# Altium schematic sheet Battery Manager.SchDoc: Battery Manager
size Tabloid; ApprovedBy: NA; CompanyName: Cospan Design LLC; DrawnBy: David McCoy; Engineer: David McCoy; DocumentNumber: 14; Revision: A; SheetNumber: 14; SheetTotal: 18; Client: OSH; ProjectPrettyName: Guppy Buddy; Project: Guppy Buddy
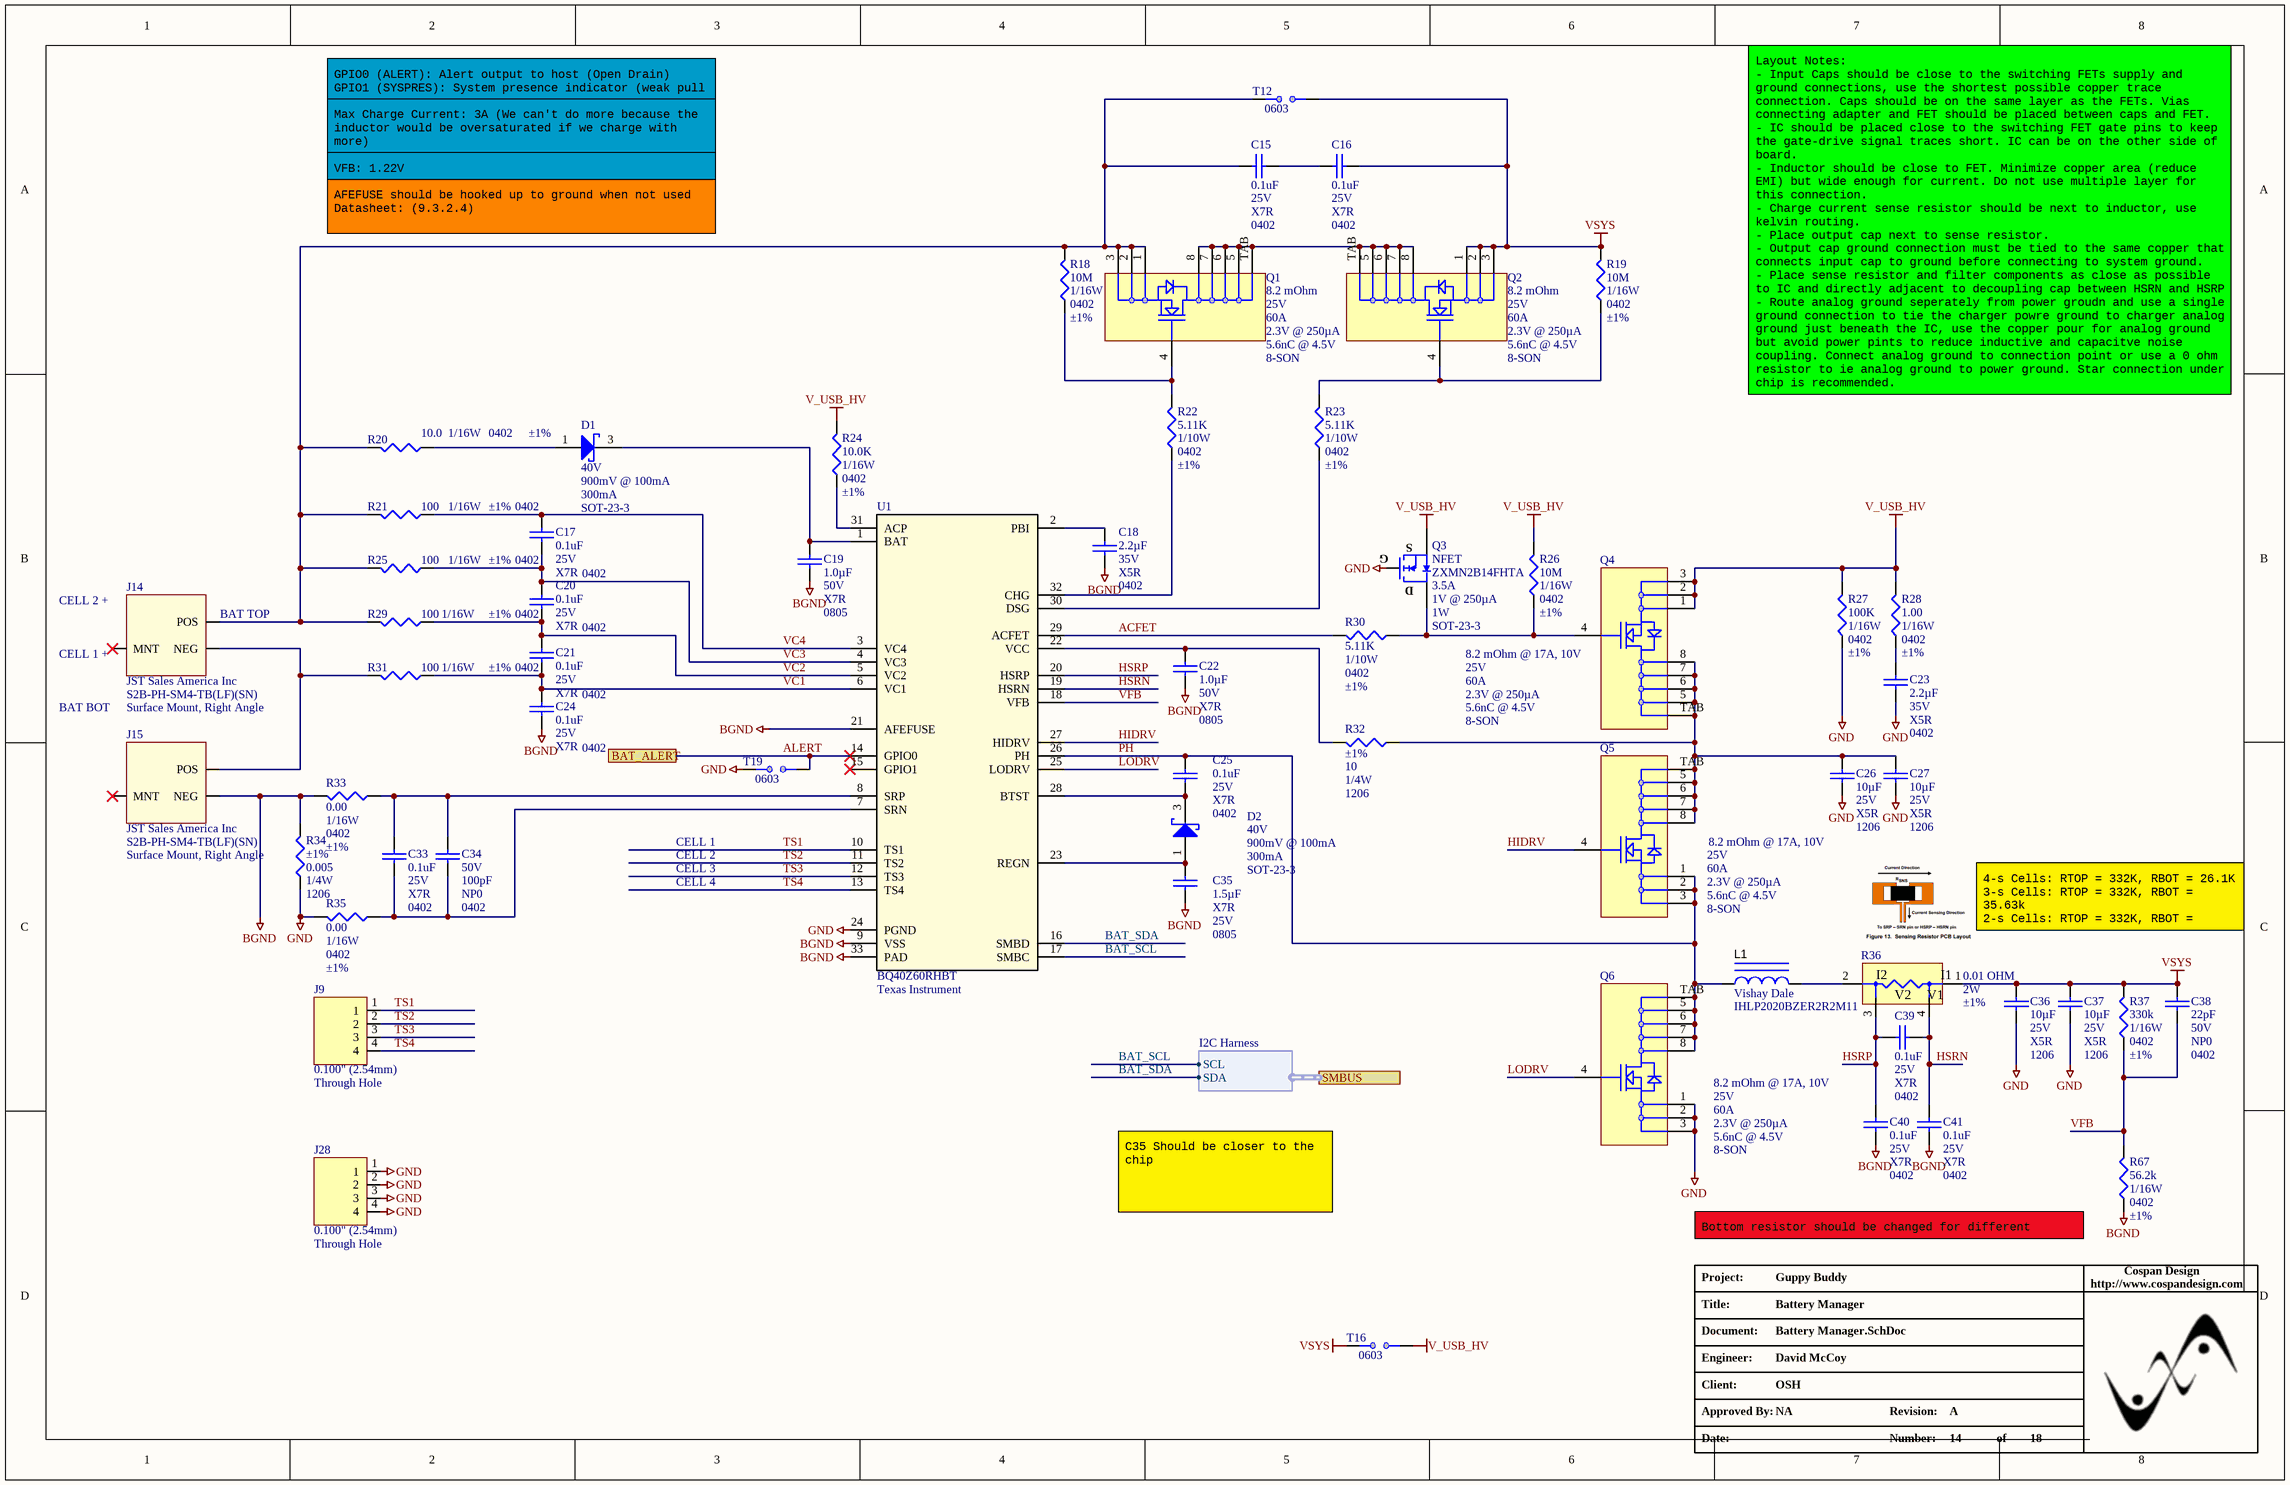
[diagram p0: Battery Manager.SchDoc]

## Parts
C15  Capacitance: 0.1uF  Voltage - Rated: 25V  Temperature Coefficient: X7R  Package / Case: 0402  [C_0402]  (hidden comment: C_0402_0.1UF_25V)
C16  Capacitance: 0.1uF  Voltage - Rated: 25V  Temperature Coefficient: X7R  Package / Case: 0402  [C_0402]  (hidden comment: C_0402_0.1UF_25V)
C17  Capacitance: 0.1uF  Voltage - Rated: 25V  Temperature Coefficient: X7R  Package / Case: 0402  [C_0402]  (hidden comment: C_0402_0.1UF_25V)
C18  Capacitance: 2.2µF  Voltage - Rated: 35V  Temperature Coefficient: X5R  Package / Case: 0402  [C_0402]  (hidden comment: C_0402_2.2uF_35V)
C19  Capacitance: 1.0µF  Voltage - Rated: 50V  Temperature Coefficient: X7R  Package / Case: 0805  [C_ERA-0805]  (hidden comment: 1.0uF)
C20  Capacitance: 0.1uF  Voltage - Rated: 25V  Temperature Coefficient: X7R  Package / Case: 0402  [C_0402]  (hidden comment: C_0402_0.1UF_25V)
C21  Capacitance: 0.1uF  Voltage - Rated: 25V  Temperature Coefficient: X7R  Package / Case: 0402  [C_0402]  (hidden comment: C_0402_0.1UF_25V)
C22  Capacitance: 1.0µF  Voltage - Rated: 50V  Temperature Coefficient: X7R  Package / Case: 0805  [C_ERA-0805]  (hidden comment: 1.0uF)
C23  Capacitance: 2.2µF  Voltage - Rated: 35V  Temperature Coefficient: X5R  Package / Case: 0402  [C_0402]  (hidden comment: C_0402_2.2uF_35V)
C24  Capacitance: 0.1uF  Voltage - Rated: 25V  Temperature Coefficient: X7R  Package / Case: 0402  [C_0402]  (hidden comment: C_0402_0.1UF_25V)
C25  Capacitance: 0.1uF  Voltage - Rated: 25V  Temperature Coefficient: X7R  Package / Case: 0402  [C_0402]  (hidden comment: C_0402_0.1UF_25V)
C26  Voltage - Rated: 25V  Temperature Coefficient: X5R  Package / Case: 1206  [CAP-1206]  (hidden comment: 10µF)
C27  Voltage - Rated: 25V  Temperature Coefficient: X5R  Package / Case: 1206  [CAP-1206]  (hidden comment: 10µF)
C33  Capacitance: 0.1uF  Voltage - Rated: 25V  Temperature Coefficient: X7R  Package / Case: 0402  [C_0402]  (hidden comment: C_0402_0.1UF_25V)
C34  Voltage - Rated: 50V  Temperature Coefficient: NP0  Package / Case: 0402  [C_0402]  (hidden comment: 100pF)
C35  Capacitance: 1.5µF  Voltage - Rated: X7R  Temperature Coefficient: 25V  Package / Case: 0805  [C_ERA-0805]  (hidden comment: C_0805_1.5uF_25V)
C36  Voltage - Rated: 25V  Temperature Coefficient: X5R  Package / Case: 1206  [CAP-1206]  (hidden comment: 10µF)
C37  Voltage - Rated: 25V  Temperature Coefficient: X5R  Package / Case: 1206  [CAP-1206]  (hidden comment: 10µF)
C38  Voltage - Rated: 50V  Temperature Coefficient: NP0  Package / Case: 0402  [C_0402]  (hidden comment: 22pF)
C39  Capacitance: 0.1uF  Voltage - Rated: 25V  Temperature Coefficient: X7R  Package / Case: 0402  [C_0402]  (hidden comment: C_0402_0.1UF_25V)
C40  Capacitance: 0.1uF  Voltage - Rated: 25V  Temperature Coefficient: X7R  Package / Case: 0402  [C_0402]  (hidden comment: C_0402_0.1UF_25V)
C41  Capacitance: 0.1uF  Voltage - Rated: 25V  Temperature Coefficient: X7R  Package / Case: 0402  [C_0402]  (hidden comment: C_0402_0.1UF_25V)
D1  Voltage - DC Reverse (Vr) (Max): 40V  Voltage - Forward (Vf) (Max) @ If: 900mV @ 100mA  Current - Average Rectified (Io): 300mA  Package / Case: SOT-23-3  [SOT23]  (hidden comment: BAT54)
D2  Voltage - DC Reverse (Vr) (Max): 40V  Voltage - Forward (Vf) (Max) @ If: 900mV @ 100mA  Current - Average Rectified (Io): 300mA  Package / Case: SOT-23-3  [SOT23]  (hidden comment: BAT54)
J9  Pitch: 0.100" (2.54mm)  Mounting Type: Through Hole  [HDR_1X4]  (hidden comment: J_HDR1X4_THRHOLE_VERT)
J14  Manufacturer: JST Sales America Inc  Manufacturer Part Number: S2B-PH-SM4-TB(LF)(SN)  Mounting Type: Surface Mount, Right Angle  [HDR_1X2_LIPO_BATTERY]  (hidden comment: J_LIPO_BAT_CONNECTOR)
J15  Manufacturer: JST Sales America Inc  Manufacturer Part Number: S2B-PH-SM4-TB(LF)(SN)  Mounting Type: Surface Mount, Right Angle  [HDR_1X2_LIPO_BATTERY]  (hidden comment: J_LIPO_BAT_CONNECTOR)
J28  Pitch: 0.100" (2.54mm)  Mounting Type: Through Hole  [HDR_1X4]  (hidden comment: J_HDR1X4_THRHOLE_VERT)
L1  Manufacturer: Vishay Dale  Manufacturer Part Number: IHLP2020BZER2R2M11  [IHLP-2020BZ]  (hidden comment: L_IHLP2020BZER2R2M11)
Q1  Rds On (Max) @ Id, Vgs: 8.2 mOhm  Drain to Source Voltage (Vdss): 25V  Current - Continuous Drain (Id) @ 25° C: 60A  Vgs(th) (Max) @ Id: 2.3V @ 250µA  Gate Charge (Qg) @ Vgs: 5.6nC @ 4.5V  Package / Case: 8-SON  [Q_TDSON-8 NexFET]  (hidden comment: N-Channel Nex_FET)
Q2  Rds On (Max) @ Id, Vgs: 8.2 mOhm  Drain to Source Voltage (Vdss): 25V  Current - Continuous Drain (Id) @ 25° C: 60A  Vgs(th) (Max) @ Id: 2.3V @ 250µA  Gate Charge (Qg) @ Vgs: 5.6nC @ 4.5V  Package / Case: 8-SON  [Q_TDSON-8 NexFET]  (hidden comment: N-Channel Nex_FET)
Q3  NFET  Manufacturer Part Number: ZXMN2B14FHTA  Current - Continuous Drain (Id) @ 25° C: 3.5A  Vgs(th) (Max) @ Id: 1V @ 250µA  Power - Max: 1W  Package / Case: SOT-23-3  [SOT-23A]
Q4  Rds On (Max) @ Id, Vgs: 8.2 mOhm @ 17A, 10V  Drain to Source Voltage (Vdss): 25V  Current - Continuous Drain (Id) @ 25° C: 60A  Vgs(th) (Max) @ Id: 2.3V @ 250µA  Gate Charge (Qg) @ Vgs: 5.6nC @ 4.5V  Package / Case: 8-SON  [Q_TDSON-8 NexFET]  (hidden comment: N-Channel Nex_FET)
Q5  Rds On (Max) @ Id, Vgs: 8.2 mOhm @ 17A, 10V  Drain to Source Voltage (Vdss): 25V  Current - Continuous Drain (Id) @ 25° C: 60A  Vgs(th) (Max) @ Id: 2.3V @ 250µA  Gate Charge (Qg) @ Vgs: 5.6nC @ 4.5V  Package / Case: 8-SON  [Q_TDSON-8 NexFET]  (hidden comment: N-Channel Nex_FET)
Q6  Rds On (Max) @ Id, Vgs: 8.2 mOhm @ 17A, 10V  Drain to Source Voltage (Vdss): 25V  Current - Continuous Drain (Id) @ 25° C: 60A  Vgs(th) (Max) @ Id: 2.3V @ 250µA  Gate Charge (Qg) @ Vgs: 5.6nC @ 4.5V  Package / Case: 8-SON  [Q_TDSON-8 NexFET]  (hidden comment: N-Channel Nex_FET)
R18  Resistance In Ohms: 10M  Power (Watts): 1/16W  Case: 0402  Tolerance: ±1%  [R_0402]  (hidden comment: R_0402_10M)
R19  Resistance In Ohms: 10M  Power (Watts): 1/16W  Case: 0402  Tolerance: ±1%  [R_0402]  (hidden comment: R_0402_10M)
R20  Resistance In Ohms: 10.0  Power (Watts): 1/16W  Case: 0402  Tolerance: ±1%  [R_0402]  (hidden comment: R_0402_10.0)
R21  Case: 0402  Resistance In Ohms: 100  Power (Watts): 1/16W  Tolerance: ±1%  [R_0402]  (hidden comment: R_0402_100.0)
R22  Resistance In Ohms: 5.11K  Power (Watts): 1/10W  Case: 0402  Tolerance: ±1%  [R_0402]  (hidden comment: 5.11k Ohms)
R23  Resistance In Ohms: 5.11K  Power (Watts): 1/10W  Case: 0402  Tolerance: ±1%  [R_0402]  (hidden comment: 5.11k Ohms)
R24  Resistance In Ohms: 10.0K  Power (Watts): 1/16W  Case: 0402  Tolerance: ±1%  [R_0402]  (hidden comment: R_0402_10.0K)
R25  Case: 0402  Resistance In Ohms: 100  Power (Watts): 1/16W  Tolerance: ±1%  [R_0402]  (hidden comment: R_0402_100.0)
R26  Resistance In Ohms: 10M  Power (Watts): 1/16W  Case: 0402  Tolerance: ±1%  [R_0402]  (hidden comment: R_0402_10M)
R27  Resistance In Ohms: 100K  Power (Watts): 1/16W  Case: 0402  Tolerance: ±1%  [R_0402]  (hidden comment: R_0402_100.0K)
R28  Resistance In Ohms: 1.00  Power (Watts): 1/16W  Case: 0402  Tolerance: ±1%  [R_0402]  (hidden comment: 1.0 Ohms)
R29  Case: 0402  Resistance In Ohms: 100  Power (Watts): 1/16W  Tolerance: ±1%  [R_0402]  (hidden comment: R_0402_100.0)
R30  Resistance In Ohms: 5.11K  Power (Watts): 1/10W  Case: 0402  Tolerance: ±1%  [R_0402]  (hidden comment: 5.11k Ohms)
R31  Case: 0402  Resistance In Ohms: 100  Power (Watts): 1/16W  Tolerance: ±1%  [R_0402]  (hidden comment: R_0402_100.0)
R32  Tolerance: ±1%  Resistance In Ohms: 10  Power (Watts): 1/4W  Case: 1206  [R_1206]  (hidden comment: R_1206_10)
R33  Resistance In Ohms: 0.00  Power (Watts): 1/16W  Case: 0402  Tolerance: ±1%  [R_0402]  (hidden comment: 0.0 Ohms)
R34  Tolerance: ±1%  Resistance In Ohms: 0.005  Power (Watts): 1/4W  Case: 1206  [R_1206]  (hidden comment: R_1206_0.005)
R35  Resistance In Ohms: 0.00  Power (Watts): 1/16W  Case: 0402  Tolerance: ±1%  [R_0402]  (hidden comment: 0.0 Ohms)
R36  0.01 OHM  Power (Watts): 2W  Tolerance: ±1%  [R_LVK25_0.003]
R37  Resistance In Ohms: 330k  Power (Watts): 1/16W  Case: 0402  Tolerance: ±1%  [R_0402]  (hidden comment: R_0402_330K)
R67  Power (Watts): 1/16W  Case: 0402  Tolerance: ±1%  [R_0402]  (hidden comment: 56.2k)
T12  Case: 0603  [ERA-0603-SOLDER_JUMPER]  (hidden comment: Place Solder Bridge to Enable)  (no BOM)
T16  Case: 0603  [ERA-0603-SOLDER_JUMPER]  (hidden comment: Place Solder Bridge to Enable)  (no BOM)
T19  Case: 0603  [ERA-0603-SOLDER_JUMPER]  (hidden comment: Place Solder Bridge to Enable)  (no BOM)
U1  Manufacturer Part Number: BQ40Z60RHBT  Manufacturer: Texas Instrument  [RHB0032E]  (hidden comment: U_BQ40Z60RHBR)

## Ports
BAT_ALERT, SMBUS (harness I2C Harness)

## Harnesses
I2C Harness: SCL, SDA

## Nets
BGND: C18.1 C19.1 C22.1 C24.1 C35.1 C40.2 C41.2 J15.2(NEG) R33.1 R34.1 R67.2 U1.9(VSS) U1.21(AFEFUSE) U1.33(PAD)
GND: C23.1 C26.1 C27.1 C36.2 C37.2 J28.1 J28.2 J28.3 J28.4 Q3.1(G) Q6.1(S1) Q6.2 Q6.3 R27.2 R34.2 R35.1 T19.2 U1.24(PGND)
V_USB_HV: Q3.2(S) Q4.1(S1) Q4.2 Q4.3 R24.1 R26.1 R27.1 R28.1 T16.1
VSYS: C16.1 C36.1 C37.1 C38.2 Q2.1(S1) Q2.2 Q2.3 R19.1 R36.1(I1) R37.1 T12.1 T16.2
ACFET: R30.1 U1.29(ACFET)
ALERT: T19.1 U1.14(GPIO0) ; port BAT_ALERT
BAT_SCL: U1.17(SMBC) ; port SMBUS.SCL
BAT_SDA: U1.16(SMBD) ; port SMBUS.SDA
HIDRV: Q5.4(G1) U1.27(HIDRV)
HSRN: C39.1 C41.1 R36.4(V1) U1.19(HSRN)
HSRP: C39.2 C40.1 R36.3(V2) U1.20(HSRP)
LODRV: Q6.4(G1) U1.25(LODRV)
PH: C25.1 L1.2 Q5.1(S1) Q5.2 Q5.3 Q6.5 Q6.6 Q6.7(D2a) Q6.8(D2b) Q6.TAB U1.26(PH)
TS1: J9.1 U1.10(TS1)
TS2: J9.2 U1.11(TS2)
TS3: J9.3 U1.12(TS3)
TS4: J9.4 U1.13(TS4)
VC1: C21.1 C24.2 R31.2 U1.6(VC1)
VC2: C20.1 C21.2 R29.2 U1.5(VC2)
VC3: C17.1 C20.2 R25.2 U1.4(VC3)
VC4: C17.2 R21.2 U1.3(VC4)
VFB: C38.1 R37.2 R67.1 U1.18(VFB)
NetC15_1: C15.1 C16.2
NetC15_2: C15.2 J14.1(POS) Q1.1(S1) Q1.2 Q1.3 R18.1 R20.1 R21.1 R25.1 R29.1 T12.2
NetC18_2: C18.2 U1.2(PBI)
NetC19_2: C19.2 D1.3(K) U1.1(BAT)
NetC22_2: C22.2 R32.1 U1.22(VCC)
NetC23_2: C23.2 R28.2
NetC25_2: C25.2 D2.3(K) U1.28(BTST)
NetC26_2: C26.2 C27.2 Q4.5 Q4.6 Q4.7(D2a) Q4.8(D2b) Q4.TAB Q5.5 Q5.6 Q5.7(D2a) Q5.8(D2b) Q5.TAB R32.2
NetC33_1: C33.1 C34.2 R33.2 U1.8(SRP)
NetC33_2: C33.2 C34.1 R35.2 U1.7(SRN)
NetC35_2: C35.2 D2.1(A) U1.23(REGN)
NetD1_1: D1.1(A) R20.2
NetJ14_2: J14.2(NEG) J15.1(POS) R31.1
NetL1_1: L1.1 R36.2(I2)
NetQ1_4: Q1.4(G1) R18.2 R22.1
NetQ1_5: Q1.5 Q1.6 Q1.7(D2a) Q1.8(D2b) Q1.TAB Q2.5 Q2.6 Q2.7(D2a) Q2.8(D2b) Q2.TAB
NetQ2_4: Q2.4(G1) R19.2 R23.1
NetQ3_3: Q3.3(D) Q4.4(G1) R26.2 R30.2
NetR22_2: R22.2 U1.32(CHG)
NetR23_2: R23.2 U1.30(DSG)
NetR24_2: R24.2 U1.31(ACP)

Not connected (* = marked no-connect by the designer): J14 MNT*; J15 MNT*; U1 15(GPIO1)*

## Notes on the sheet
- GPIO0 (ALERT): Alert output to host (Open Drain)
  GPIO1 (SYSPRES): System presence indicator (weak pull up)
- Max Charge Current: 3A (We can't do more because the inductor would be oversaturated if we charge with more)
- VFB: 1.22V
- AFEFUSE should be hooked up to ground when not used
  Datasheet: (9.3.2.4)
- Layout Notes:
  - Input Caps should be close to the switching FETs supply and ground connections, use the shortest possible copper trace connection. Caps should be on the same layer as the FETs. Vias connecting adapter and FET should be placed between caps and FET.
  - IC should be placed close to the switching FET gate pins to keep the gate-drive signal traces short. IC can be on the other side of board.
  - Inductor should be close to FET. Minimize copper area (reduce EMI) but wide enough for current. Do not use multiple layer for this connection.
  - Charge current sense resistor should be next to inductor, use kelvin routing.
  - Place output cap next to sense resistor.
  - Output cap ground connection must be tied to the same copper that connects input cap to ground before connecting to system ground.
  - Place sense resistor and filter components as close as possible to IC and directly adjacent to decoupling cap between HSRN and HSRP
  - Route analog ground seperately from power groudn and use a single ground connection to tie the charger powre ground to charger analog ground just beneath the IC, use the copper pour for analog ground but avoid power pints to reduce inductive and capacitve noise coupling. Connect analog ground to connection point or use a 0 ohm resistor to ie analog ground to power ground. Star connection under chip is recommended.
  - It is critical that the exposed thermal pad on the back side of the IC package be soldered t othe PCB ground.
- (near J14) CELL 2 +
- (near J14) BAT TOP
- (near J14) CELL 1 +
- BAT BOT
- CELL 1
- CELL 2
- CELL 3
- CELL 4
- 4-s Cells: RTOP = 332K, RBOT = 26.1K
  3-s Cells: RTOP = 332K, RBOT = 35.63k
  2-s Cells: RTOP = 332K, RBOT = 56.13K
- C35 Should be closer to the chip
- (near R67) Bottom resistor should be changed for different batteries
- Project:
- http://www.cospandesign.com
- Cospan Design
- Document:
- Engineer:
- Title:
- Client:
- Approved By:
- Revision:
- Date:
- Number:
- of

## Library data of the parts
C15-C17 C20 C21 C24 C25 C33 C39-C41 = C_0402_0.1UF_25V: CAP CER 0.1UF 25V X6S 0402; Manufacturer 1: Yageo; Manufacturer Part Number 1: CC0402KRX7R8BB104; Description 1: Cap Ceramic 0.1uF 25V X7R 10% SMD 0402 125C Paper T/R; Tolerance: 10%; Dissipation Factor: 3.5%; ComponentLink1URL: https://product.tdk.com/info/en/catalog/datasheets/mlcc_commercial_general_en.pdf; ComponentLink1Description: https://product.tdk.com/info/en/catalog/datasheets/mlcc_commercial_general_en.pdf; Supplier 1: Digi-Key; Supplier Part Number 1: 311-2077-1-ND; Stock 1: 0; Pricing 1: 1=0.1, 10=0.048, 100=0.0215, 500=0.01534, 1000=0.01205, 2500=0.01095, 5000=0.01007 (USD); Mount: Surface Mount; Case/Package: 0402; Case Code (Imperial): 0402; Case Code (Metric): 1005; Min Operating Temperature: -55°C; Max Operating Temperature: 125°C; Voltage Rating: 25V; Voltage Rating (DC): 25V; Packaging: Tape and Reel; Dielectric: X7R; Termination: SMD/SMT; Composition: Ceramic; Length: 1mm; Height: 0.5mm; Width: 0.02inch; Thickness: 0.022inch; Depth: 0.5mm; Radiation Hardening: No; Lead Free: Lead Free; Halogen Free: Halogen Free; ComponentLink2URL: https://datasheet.ciiva.com/11464/upy-gphc-x7r-6-3v-to-50v-8-11464889.pdf; ComponentLink2Description: https://datasheet.ciiva.com/11464/upy-gphc-x7r-6-3v-to-50v-8-11464889.pdf; ComponentLink3URL: https://datasheet.ciiva.com/13210/upy-gphc-x7r-6-3v-to-50v-8-12304-13210908.pdf; ComponentLink3Description: https://datasheet.ciiva.com/13210/upy-gphc-x7r-6-3v-to-50v-8-12304-13210908.pdf; ComponentLink4URL: https://datasheet.ciiva.com/17437/upy-gphc-x7r-6-3v-to-50v-8-17437357.pdf; ComponentLink4Description: https://datasheet.ciiva.com/17437/upy-gphc-x7r-6-3v-to-50v-8-17437357.pdf
C18 C23 = C_0402_2.2uF_35V: CAP CER 2.2UF 35V 20% X5R 0402; Manufacturer: TDK Corporation; Manufacturer Part Number: C1005X5R1V225K050BC; Tolerance: ±10%; Supplier 1: Digi-Key; Supplier Part Number 1: 445-9028-1-ND; RoHS: RoHS Compliant; Category: Capacitors; Stock 1: 300469; Packaging: Cut Tape (CT); Mounting Type: Surface Mount, MLCC; Operating Temperature: -55°C ~ 85°C; Applications: General Purpose; Ratings: -; Size / Dimension: 0.039" L x 0.020" W (1.00mm x 0.50mm); Height - Seated (Max): -; Thickness (Max): 0.022" (0.55mm); Lead Spacing: -; Features: Low ESL; Lead Style: -; ComponentLink1URL: https://product.tdk.com/info/en/catalog/datasheets/mlcc_commercial_general_en.pdf; ComponentLink1Description: https://product.tdk.com/info/en/catalog/datasheets/mlcc_commercial_general_en.pdf; Pricing 1: 1=0.36, 10=0.253, 100=0.1518, 500=0.11386, 1000=0.09614, 2500=0.09108, 5000=0.08602 (USD); Part Status: Active; Failure Rate: -
C19 C22 = C_0805_1.0uF_50V: CAP CER 1UF 50V X7R 0805; Manufacturer 1: Samsung; Manufacturer Part Number 1: CL21B105KBFNNNG; Tolerance: 10%; Description 1: Cap Ceramic 1uF 50V X7R 10% SMD 0805 125C Embossed T/R; Material: Ceramic; Supplier 1: Digi-Key; Stock 1: 0; Pricing 1: 1=0.13, 10=0.097, 100=0.043, 500=0.03072, 1000=0.02413 (USD); Thickness: 0.053inch; Packaging: Tape and Reel; ComponentLink1URL: http://search.murata.co.jp/Ceramy/image/img/PDF/ENG/GRM21BR71H105KA12.pdf; ComponentLink1Description: http://search.murata.co.jp/Ceramy/image/img/PDF/ENG/GRM21BR71H105KA12.pdf; Supplier Part Number 1: 1276-6470-6-ND; Mount: Surface Mount; Case/Package: 0805; Case Code (Metric): 2012; Case Code (Imperial): 0805; Contact Plating: Nickel,Tin; Min Operating Temperature: -55°C; Max Operating Temperature: 125°C; Voltage Rating: 50V; Package Quantity: 3000; Dielectric: X7R; Termination: Wraparound; Voltage: 50V; Length: 2mm; Width: 0.049inch; Depth: 1.25mm; ComponentLink2URL: https://datasheet.ciiva.com/16428/cl05b104kq5nnnc-16428872.pdf; ComponentLink2Description: https://datasheet.ciiva.com/16428/cl05b104kq5nnnc-16428872.pdf; ComponentLink3URL: https://datasheet.ciiva.com/26310/mlcc-catalogdownload2013-eng-26310125.pdf; ComponentLink3Description: https://datasheet.ciiva.com/26310/mlcc-catalogdownload2013-eng-26310125.pdf; ComponentLink4URL: https://datasheet.ciiva.com/25733/cl21b105kbfnnng-25733278.pdf; ComponentLink4Description: https://datasheet.ciiva.com/25733/cl21b105kbfnnng-25733278.pdf; ComponentLink5URL: https://datasheet.ciiva.com/29199/455898-da-01-en-vs-kondensator-0805-29199201.pdf; ComponentLink5Description: https://datasheet.ciiva.com/29199/455898-da-01-en-vs-kondensator-0805-29199201.pdf
C26 C27 C36 C37 = C_1206_10UF_25V: CAP CER 10UF 25V X5R 1206; Manufacturer 1: Samsung; Manufacturer Part Number 1: CL31A106KAHNNNE; Tolerance: 10%; Description 1: Cap Ceramic 10uF 25V X5R 10% SMD 1206 85C T/R; Material: Ceramic; Supplier 1: Digi-Key; Supplier Part Number 1: 1276-1075-6-ND; Stock 1: 0; Height: 1.6mm; Thickness: 0.071inch; Packaging: Tape and Reel; ComponentLink1URL: http://search.murata.co.jp/Ceramy/image/img/PDF/ENG/GRM31CR61E106MA12.pdf; ComponentLink1Description: http://search.murata.co.jp/Ceramy/image/img/PDF/ENG/GRM31CR61E106MA12.pdf; Capacitance: 10µF; Pricing 1: 1=0.28, 10=0.188, 100=0.095, 500=0.065, 1000=0.0575 (USD); Mount: Surface Mount; Case/Package: 1206; Case Code (Metric): 3216; Case Code (Imperial): 1206; Contact Plating: Tin; Min Operating Temperature: -55°C; Max Operating Temperature: 85°C; Dielectric: X5R; Voltage: 25V; Voltage Rating (DC): 25V; Voltage Rating: 25V; Length: 3.2mm; Depth: 1.6mm; Width: 0.063inch; Radiation Hardening: No; Lead Free: Lead Free; ComponentLink2URL: https://datasheet.ciiva.com/25710/cl31a106kahnnne-25710837.pdf; ComponentLink2Description: https://datasheet.ciiva.com/25710/cl31a106kahnnne-25710837.pdf; ComponentLink3URL: https://datasheet.ciiva.com/15195/getdatasheetpartid-355210-15195990.pdf; ComponentLink3Description: https://datasheet.ciiva.com/15195/getdatasheetpartid-355210-15195990.pdf; ComponentLink4URL: https://datasheet.ciiva.com/16740/cl31a106kahnnne-16740633.pdf; ComponentLink4Description: https://datasheet.ciiva.com/16740/cl31a106kahnnne-16740633.pdf; ComponentLink5URL: https://datasheet.ciiva.com/29201/452519-da-01-en-vs-kondensator-1206-29201124.pdf; ComponentLink5Description: https://datasheet.ciiva.com/29201/452519-da-01-en-vs-kondensator-1206-29201124.pdf
C34 = C_0402_100PF: CAP CER 100PF 50V 5% C0G 0402; Manufacturer: Murata Electronics North America; Manufacturer Part Number: GRM1555C1H101JA01D; Supplier 1: Digi-Key; Supplier Part Number 1: 490-5922-1-ND; RoHS: RoHS Compliant; Category: Capacitors; Stock 1: 1663893; Tolerance: ±5%; Mounting Type: Surface Mount, MLCC; Operating Temperature: -55°C ~ 125°C; Applications: General Purpose; Ratings: -; Size / Dimension: 0.039" L x 0.020" W (1.00mm x 0.50mm); Lead Spacing: -; Features: -; Packaging: Cut Tape (CT); Lead Style: -; ComponentLink1URL: http://www.murata.com/~/media/webrenewal/support/library/catalog/products/capacitor/mlcc/c02e.pdf; ComponentLink1Description: http://www.murata.com/~/media/webrenewal/support/library/catalog/products/capacitor/mlcc/c02e.pdf; Capacitance: 100pF; Pricing 1: 1=0.1, 10=0.012, 50=0.0066, 100=0.0055, 250=0.00452, 500=0.00386, 1000=0.003, 5000=0.0025 (USD); Part Status: Active; Failure Rate: *; Height - Seated (Max): -; Thickness (Max): 0.022" (0.55mm)
C35 = C_0805_1.5uF_25V: 1.5µF ±10% 25V Ceramic Capacitor X7R 0805 (2012 Metric); Manufacturer: Murata Electronics North America; Manufacturer Part Number: GRM21BR71E155KA88L; Supplier 1: Digi-Key; RoHS: RoHS Compliant; Category: Capacitors; Stock 1: 7266; Pricing 1: 1=0.29, 10=0.24, 50=0.135, 100=0.12, 250=0.09, 500=0.0795, 1000=0.0705 (USD); Packaging: Cut Tape (CT); Part Status: Active; Tolerance: ±10%; Operating Temperature: -55°C ~ 125°C; Features: -; Ratings: -; Applications: General Purpose; Failure Rate: *; Mounting Type: Surface Mount, MLCC; Size / Dimension: 0.079" L x 0.049" W (2.00mm x 1.25mm); Height - Seated (Max): -; Thickness (Max): 0.053" (1.35mm); Lead Spacing: -; Lead Style: -; ComponentLink1URL: http://www.murata.com/~/media/webrenewal/support/library/catalog/products/capacitor/mlcc/c02e.pdf; ComponentLink1Description: http://www.murata.com/~/media/webrenewal/support/library/catalog/products/capacitor/mlcc/c02e.pdf; Supplier Part Number 1: 490-3330-1-ND
C38 = C_0402_22PF_50V: CAP CER 22PF 50V NP0 0402; Manufacturer: Murata Electronics North America; Manufacturer Part Number: GRM1555C1H220FA01D; Tolerance: ±1%; Supplier 1: Digi-Key; Supplier Part Number 1: 490-8589-1-ND; RoHS: RoHS Compliant; Category: Capacitors; Stock 1: 606100; Mounting Type: Surface Mount, MLCC; Operating Temperature: -55°C ~ 125°C; Applications: General Purpose; Ratings: -; Size / Dimension: 0.039" L x 0.020" W (1.00mm x 0.50mm); Height - Seated (Max): -; Thickness (Max): 0.022" (0.55mm); Lead Spacing: -; Features: -; Packaging: Cut Tape (CT); Lead Style: -; ComponentLink1URL: http://search.murata.co.jp/Ceramy/image/img/A01X/G101/ENG/GRM1555C1H220FA01-01.pdf; ComponentLink1Description: http://search.murata.co.jp/Ceramy/image/img/A01X/G101/ENG/GRM1555C1H220FA01-01.pdf; Capacitance: 22pF; Pricing 1: 1=0.1, 10=0.05, 100=0.0223, 500=0.01594, 1000=0.01252, 2500=0.01138, 5000=0.01047 (USD); Part Status: Active
D1 D2 = D_SCHOTT_BAT54WFILM: DIODE SCHOTTKY 40V 300MA SOT-23; Manufacturer 1: STMicroelectronics; Description 1: DIODE SCHOTTKY 40V 300MA SOT323; Forward Voltage: 900mV; Max Surge Current: 1A; Recovery Time: 5ns; Peak Reverse Current: 1uA; Element Configuration: Single; Polarity: Standard; Voltage Rating (DC): 30V; Capacitance: 10pF; ComponentLink1URL: http://www.fairchildsemi.com/ds/BA/BAT54.pdf; ComponentLink1Description: http://www.fairchildsemi.com/ds/BA/BAT54.pdf; Supplier 1: Digi-Key; Supplier Part Number 1: 497-2530-6-ND; Stock 1: 16371; Pricing 1: 1=0.38, 10=0.286, 100=0.1617, 500=0.10706, 1000=0.08209 (USD); Mount: Surface Mount; Case/Package: SOT-323; Number of Pins: 3; Min Operating Temperature: -40°C; Max Operating Temperature: 150°C; Package Quantity: 1; Packaging: Tape and Reel; Forward Current: 300mA; Max Reverse Leakage Current: 1uA; Average Rectified Current: 300mA; Reverse Recovery Time: 5ns; Max Repetitive Reverse Voltage (Vrrm): 40V; Peak Non-Repetitive Surge Current: 1A; Max Forward Surge Current (Ifsm): 1A; Current Rating: 300mA; Output Current: 300mA; Max Reverse Voltage (DC): 40V; Length: 2mm; Height: 1.1mm; Width: 1.25mm; Radiation Hardening: No; Lead Free: Lead Free; ComponentLink2URL: https://datasheet.ciiva.com/4714/cd00001322-105648-4714481.pdf; ComponentLink2Description: https://datasheet.ciiva.com/4714/cd00001322-105648-4714481.pdf; ComponentLink3URL: https://datasheet.ciiva.com/15144/getdatasheetpartid-39206-15144069.pdf; ComponentLink3Description: https://datasheet.ciiva.com/15144/getdatasheetpartid-39206-15144069.pdf; ComponentLink4URL: https://datasheet.ciiva.com/915/cd00001322-915500.pdf; ComponentLink4Description: https://datasheet.ciiva.com/915/cd00001322-915500.pdf; ComponentLink5URL: https://datasheet.ciiva.com/915/cd00001322-915501.pdf; ComponentLink5Description: https://datasheet.ciiva.com/915/cd00001322-915501.pdf; ComponentLink6URL: https://datasheet.ciiva.com/915/cd00001322-915502.pdf; ComponentLink6Description: https://datasheet.ciiva.com/915/cd00001322-915502.pdf; Manufacturer Part Number 1: BAT54WFILM
J9 J28 = J_HDR1X4_THRHOLE_VERT: CONN HEADER .100" 4POS TIN PCB; Manufacturer: Samtec; Manufacturer Part Number: TSW-104-07-T-S; Connector Type: Unshrouded; Number of Positions: 4; Number of Positions Loaded: All; Supplier 1: Samtec; Supplier Part Number 1: TSW-104-07-T-S; RoHS: RoHS Compliant; Category: Connectors, Interconnects; Number of Rows: 1; Row Spacing: -; Height Stacking (Mating): -; Height Above Board: 0.100" (2.54mm); Contact Mating Length: 0.166" (4.22mm); Termination: Solder; Contact Finish: Tin; Contact Finish Thickness: 200µin (5.08µm); Features: -; Color: Black; Packaging: Bulk; ComponentLink1URL: http://www.samtec.com/ftppub/cpdf/TX-MKT1.PDF; ComponentLink1Description: http://www.samtec.com/ftppub/cpdf/TX-MKT1.PDF; Pricing: 1=0.134
J14 J15 = J_LIPO_BAT_CONNECTOR: CONN HEADER PH SIDE 2POS 2MM SMD; Connector Type: Header, Shrouded; Number of Positions: 2; Number of Positions Loaded: All; Pitch: 0.079" (2.00mm); Supplier 1: Digi-Key; Supplier Part Number 1: 455-1749-1-ND; RoHS: RoHS Compliant; Category: Connectors, Interconnects; Stock 1: 29466; Pricing: 1=0.51, 10=0.474, 100=0.3947, 500=0.31576 (USD); Contact Type: Male Pin; Number of Rows: 1; Row Spacing: -; Contact Mating Length: -; Termination: Solder; Fastening Type: -; Features: Solder Retention; Contact Finish: Tin; Contact Finish Thickness: -; Color: Natural; Packaging: Cut Tape (CT); ComponentLink1URL: http://www.jst-mfg.com/product/pdf/eng/ePH.pdf; ComponentLink1Description: http://www.jst-mfg.com/product/pdf/eng/ePH.pdf
L1 = L_IHLP2020BZER2R2M11: 2.2µH Shielded Molded Inductor 5A 37.7 mOhm Max; Tolerance: ±20%; Supplier 1: Digi-Key; RoHS: RoHS Compliant; Category: Inductors, Coils, Chokes; Stock 1: 9448; Pricing 1: 1=2.39, 10=2.208, 100=1.5456, 500=1.2512, 1000=1.1408 (USD); Packaging: Cut Tape (CT); Part Status: Active; Type: Molded; Material - Core: -; Shielding: Shielded; DC Resistance (DCR): 37.7 mOhm Max; Q @ Freq: -; Ratings: -; Operating Temperature: -55°C ~ 125°C; Mounting Type: Surface Mount; Package / Case: Nonstandard; Size / Dimension: 0.216" L x 0.204" W (5.49mm x 5.18mm); Height - Seated (Max): 0.079" (2.00mm); ComponentLink1URL: http://www.vishay.com/docs/34261/ihlp2020bz11.pdf; ComponentLink1Description: http://www.vishay.com/docs/34261/ihlp2020bz11.pdf; Supplier Part Number 1: 541-1220-1-ND; Supplier Device Package: -
Q1 Q2 Q4-Q6 = Q_N-CH_8SON_60A_9.5mOHM: MOSFET N-CH 25V 60A 8-SON; Manufacturer: Texas Instruments; Manufacturer Part Number: CSD16409Q3; FET Type: MOSFET N-Channel, Metal Oxide; FET Feature: Logic Level Gate; Input Capacitance (Ciss) @ Vds: 800pF @ 12.5V; Power - Max: 2.6W; Supplier 1: Digi-Key; Supplier Part Number 1: 296-24253-1-ND; RoHS: RoHS Compliant By Exemption; Category: Discrete Semiconductor Products; Stock 1: 39445; Pricing: 1=1.72, 25=1.356, 100=1.2204, 250=1.0622, 500=0.9492, 1000=0.7458 (USD); Mounting Type: Surface Mount; Supplier Device Package: 8-SON; Packaging: Cut Tape (CT); ComponentLink1URL: http://focus.ti.com/lit/ds/symlink/csd16409q3.pdf; ComponentLink1Description: http://focus.ti.com/lit/ds/symlink/csd16409q3.pdf
Q3 = Q_NFET_3.50A_SOT23: MOSFET N-CH 20V 3.5A SOT23-3; Manufacturer: Diodes/Zetex; FET Type: MOSFET N-Channel, Metal Oxide; FET Feature: Logic Level Gate; Rds On (Max) @ Id, Vgs: 55 mOhm @ 3.5A, 4.5V; Gate Charge (Qg) @ Vgs: 11nC @ 4.5V; Input Capacitance (Ciss) @ Vds: 872pF @ 10V; Supplier 1: Digi-Key; Supplier Part Number 1: ZXMN2B14FHCT-ND; RoHS: RoHS Compliant; Category: Discrete Semiconductor Products; Stock 1: 14777; Pricing: 1=0.88, 10=0.764, 100=0.603, 250=0.5226, 500=0.4422, 1000=0.35175 (USD); Drain to Source Voltage (Vdss): 20V; Mounting Type: Surface Mount; Supplier Device Package: SOT-23-3; Packaging: Cut Tape (CT); ComponentLink1URL: http://www.diodes.com/datasheets/ZXMN2B14FH.pdf; ComponentLink1Description: http://www.diodes.com/datasheets/ZXMN2B14FH.pdf
R18 R19 R26 = R_0402_10M: RES SMD 10M OHM 1% 1/16W 0402; Manufacturer: Yageo; Manufacturer Part Number: RC0402FR-0710ML; Temperature Coefficient: ±100ppm/°C; Supplier 1: Digi-Key; RoHS: RoHS Compliant; Category: Resistors; Stock 1: 285948; Pricing 1: 1=0.1, 10=0.015, 25=0.0108, 100=0.006, 250=0.00456, 500=0.00364, 1000=0.00268, 2500=0.00233, 5000=0.00192 (USD); Packaging: Cut Tape (CT); Part Status: Active; Resistance (Ohms): 10M; Composition: Thick Film; Features: Moisture Resistant; Operating Temperature: -55°C ~ 155°C; Package / Case: 0402 (1005 Metric); Supplier Device Package: 0402; Size / Dimension: 0.039" L x 0.020" W (1.00mm x 0.50mm); Height - Seated (Max): 0.016" (0.40mm); Number of Terminations: 2; Failure Rate: -; ComponentLink1URL: http://www.yageo.com/NewPortal/yageodocoutput?fileName=/pdf/R-Chip/PYu-RC_Group_51_RoHS_L_4.pdf; ComponentLink1Description: http://www.yageo.com/NewPortal/yageodocoutput?fileName=/pdf/R-Chip/PYu-RC_Group_51_RoHS_L_4.pdf; Supplier Part Number 1: 311-10.0MLRCT-ND
R20 = R_0402_10.0: RES 10.0 OHM 1/16W 1% 0402 SMD; Manufacturer: Yageo; Manufacturer Part Number: RC0402FR-0710RL; Temperature Coefficient: ±200ppm/°C; Supplier 1: Digi-Key; Supplier Part Number 1: 311-10.0LRCT-ND; RoHS: RoHS Compliant; Category: Resistors; Stock 1: 1266033; Composition: Thick Film; Features: Moisture Resistant; Packaging: Cut Tape (CT); ComponentLink1URL: http://www.yageo.com/documents/recent/PYu-RC_Group_51_RoHS_L_7.pdf; ComponentLink1Description: http://www.yageo.com/documents/recent/PYu-RC_Group_51_RoHS_L_7.pdf; Pricing 1: 1=0.1, 10=0.014, 100=0.0056, 1000=0.00253, 2500=0.0022, 5000=0.00181 (USD); Part Status: Active; Operating Temperature: -55°C ~ 155°C; Package / Case: 0402 (1005 Metric); Supplier Device Package: 0402; Size / Dimension: 0.039" L x 0.020" W (1.00mm x 0.50mm); Height - Seated (Max): 0.016" (0.40mm); Failure Rate: -
R21 R25 R29 R31 = R_0402_100.0: RES 100 OHM 1/16W 1% 0402 SMD; Manufacturer: Yageo; Manufacturer Part Number: RC0402FR-07100RL; Temperature Coefficient: ±100ppm/°C; Supplier 1: Digi-Key; RoHS: RoHS Compliant; Category: Resistors; Stock 1: 2051645; Pricing 1: 1=0.1, 10=0.013, 25=0.0096, 100=0.0054, 250=0.00412, 500=0.00328, 1000=0.00242, 2500=0.0021, 5000=0.00173 (USD); Packaging: Cut Tape (CT); Resistance (Ohms): 100; Composition: Thick Film; Features: Moisture Resistant; Operating Temperature: -55°C ~ 155°C; Package / Case: 0402 (1005 Metric); Supplier Device Package: 0402; Size / Dimension: 0.039" L x 0.020" W (1.00mm x 0.50mm); Height: 0.016" (0.40mm); Number of Terminations: 2; ComponentLink1URL: http://www.yageo.com/documents/recent/PYu-RC_Group_51_RoHS_L_2.pdf; ComponentLink1Description: http://www.yageo.com/documents/recent/PYu-RC_Group_51_RoHS_L_2.pdf; Supplier Part Number 1: 311-100LRCT-ND
R22 R23 R30 = R_0402_5.11K: RES 5.11K OHM 1/10W 1% 0402 SMD; Manufacturer: Panasonic - ECG; Manufacturer Part Number: ERJ-2RKF5111X; Temperature Coefficient: ±100ppm/°C; Supplier 1: Digi-Key; Supplier Part Number 1: P5.11KLCT-ND; RoHS: RoHS Compliant; Category: Resistors; Stock 1: 491807; Pricing: 1=0.06, 50=0.0242, 100=0.0184, 250=0.01364, 500=0.01008, 1000=0.00672, 5000=0.00473 (USD); Resistance (Ohms): 5.11K; Composition: Thick Film; Features: -; Size / Dimension: 0.039" L x 0.020" W (1.00mm x 0.50mm); Height: 0.014" (0.35mm); Number of Terminations: 2; Packaging: Cut Tape (CT); Package / Case: 0402 (1005 Metric); ComponentLink1URL: http://industrial.panasonic.com/www-cgi/jvcr13pz.cgi?E+PZ+3+AOA0002+ERJ2RKF5111X+7+WW; ComponentLink1Description: http://industrial.panasonic.com/www-cgi/jvcr13pz.cgi?E+PZ+3+AOA0002+ERJ2RKF5111X+7+WW
R24 = R_0402_10.0K: RES 10.0K OHM 1/16W 1% 0402 SMD; Manufacturer: Stackpole Electronics Inc; Manufacturer Part Number: RMCF0402FT10K0; Resistance (Ohms): 10k; Temperature Coefficient: ±100ppm/°C; Supplier 1: Digi-Key; Supplier Part Number 1: RMCF0402FT10K0CT-ND; RoHS: RoHS Compliant; Category: Resistors; Stock 1: 234525; Pricing: 1=0.04, 10=0.025, 50=0.0138, 100=0.0105, 250=0.0078, 500=0.00576, 1000=0.00384, 2500=0.00324, 5000=0.0027 (USD); Composition: Thick Film; Features: -; Package / Case: 0402 (1005 Metric); Size / Dimension: 0.039" L x 0.020" W (1.00mm x 0.50mm); Height: 0.016" (0.40mm); Number of Terminations: 2; Packaging: Cut Tape (CT); ComponentLink1URL: http://www.seielect.com/Catalog/SEI-RMCF_RMCP.pdf; ComponentLink1Description: http://www.seielect.com/Catalog/SEI-RMCF_RMCP.pdf
R27 = R_0402_100.0K: RES 100K OHM 1/16W 1% 0402 SMD; Manufacturer: Stackpole Electronics Inc; Manufacturer Part Number: RMCF0402FT100K; Temperature Coefficient: ±100ppm/°C; RoHS: RoHS Compliant; Category: Resistors; Composition: Thick Film; Features: -; Lead Style: Surface Mount (SMD - SMT); Packaging: Cut Tape (CT); Resistance (Ohms): 100k; Package / Case: 0402 (1005 Metric); Supplier Device Package: 0402; Size / Dimension: 0.039" L x 0.020" W (1.00mm x 0.50mm); Height: 0.016" (0.40mm); Number of Terminations: 2; Supplier 1: Digi-Key; Supplier Part Number 1: RMCF0402FT100KCT-ND; Stock 1: 18746; Pricing: 1=0.04, 10=0.025, 50=0.0138, 100=0.0105, 250=0.0078, 500=0.00576, 1000=0.00384, 2500=0.00324, 5000=0.0027 (USD); ComponentLink1URL: http://www.seielect.com/Catalog/SEI-RMCF_RMCP.pdf; ComponentLink1Description: http://www.seielect.com/Catalog/SEI-RMCF_RMCP.pdf
R28 = R_0402_1.00: RES 1.00 OHM 1/16W 1% 0402 SMD; Manufacturer: Yageo; Manufacturer Part Number: RC0402FR-071RL; Resistance (Ohms): 1; Temperature Coefficient: ±200ppm/°C; Supplier 1: Digi-Key; RoHS: RoHS Compliant; Category: Resistors; Stock 1: 426521; Pricing 1: 1=0.1, 10=0.02, 25=0.0144, 100=0.0082, 250=0.00624, 500=0.00498, 1000=0.00367, 2500=0.00319, 5000=0.00263 (USD); Packaging: Cut Tape (CT); Composition: Thick Film; Features: Moisture Resistant; Operating Temperature: -55°C ~ 155°C; Package / Case: 0402 (1005 Metric); Supplier Device Package: 0402; Size / Dimension: 0.039" L x 0.020" W (1.00mm x 0.50mm); Height: 0.016" (0.40mm); Number of Terminations: 2; ComponentLink1URL: http://www.yageo.com/NewPortal/yageodocoutput?fileName=/pdf/R-Chip/PYu-RC_Group_51_RoHS_L_3.pdf; ComponentLink1Description: http://www.yageo.com/NewPortal/yageodocoutput?fileName=/pdf/R-Chip/PYu-RC_Group_51_RoHS_L_3.pdf; Supplier Part Number 1: 311-1.00LRCT-ND
R32 = R_1206_10: RES SMD 10 OHM 1% 1/4W 1206; Manufacturer: Yageo; Manufacturer Part Number: RC1206FR-0710RL; Temperature Coefficient: ±200ppm/°C; Supplier 1: Digi-Key; RoHS: RoHS Compliant; Category: Resistors; Stock 1: 1422829; Pricing 1: 1=0.1, 10=0.032, 25=0.0232, 100=0.013, 250=0.00992, 500=0.00792, 1000=0.00583, 2500=0.00506 (USD); Packaging: Cut Tape (CT); Part Status: Active; Resistance (Ohms): 10; Composition: Thick Film; Features: Moisture Resistant; Operating Temperature: -55°C ~ 155°C; Package / Case: 1206 (3216 Metric); Supplier Device Package: 1206; Size / Dimension: 0.122" L x 0.063" W (3.10mm x 1.60mm); Height - Seated (Max): 0.026" (0.65mm); Number of Terminations: 2; Failure Rate: -; ComponentLink1URL: http://www.yageo.com/NewPortal/yageodocoutput?fileName=/pdf/R-Chip/PYu-RC_Group_51_RoHS_L_4.pdf; ComponentLink1Description: http://www.yageo.com/NewPortal/yageodocoutput?fileName=/pdf/R-Chip/PYu-RC_Group_51_RoHS_L_4.pdf; Supplier Part Number 1: 311-10.0FRCT-ND
R33 R35 = R_0402_0.00: RES 0.00 OHM 1/16W 1% 0402 SMD; Manufacturer: Yageo; Manufacturer Part Number: RC0402JR-070RL; Supplier 1: Digi-Key; RoHS: RoHS Compliant; Category: Resistors; Stock 1: 14041464; Pricing 1: 1=0.1, 10=0.01, 25=0.0068, 50=0.0052, 100=0.0038, 250=0.00288, 500=0.0023, 1000=0.0017, 5000=0.00122 (USD); Packaging: Cut Tape (CT); Part Status: Active; Composition: Thick Film; Features: Moisture Resistant; Temperature Coefficient: -; Operating Temperature: -55°C ~ 155°C; Package / Case: 0402 (1005 Metric); Supplier Device Package: 0402; Size / Dimension: 0.039" L x 0.020" W (1.00mm x 0.50mm); Height - Seated (Max): 0.016" (0.40mm); Failure Rate: -; ComponentLink1URL: http://www.yageo.com/documents/recent/PYu-RC_Group_51_RoHS_L_7.pdf; ComponentLink1Description: http://www.yageo.com/documents/recent/PYu-RC_Group_51_RoHS_L_7.pdf; Supplier Part Number 1: 311-0.0JRCT-ND
R34 = R_1206_0.005: RES SMD 0.005 OHM 1% 1W 1206; Manufacturer: Stackpole Electronics Inc.; Manufacturer Part Number: CSRF1206FT5L00; Temperature Coefficient: ±100ppm/°C; Supplier 1: Digi-Key; RoHS: RoHS Compliant; Category: Resistors; Stock 1: 42538; Pricing 1: 1=0.63, 10=0.468, 50=0.33, 100=0.2723, 250=0.23652, 500=0.1925, 1000=0.15268 (USD); Packaging: Cut Tape (CT); Part Status: Active; Resistance (Ohms): 0.005; Composition: Metal Foil; Features: Automotive AEC-Q200, Current Sense, Moisture Resistant; Operating Temperature: -55°C ~ 170°C; Package / Case: 1206 (3216 Metric); Supplier Device Package: 1206; Size / Dimension: 0.126" L x 0.063" W (3.20mm x 1.60mm); Height - Seated (Max): 0.033" (0.85mm); Number of Terminations: 2; Failure Rate: -; ComponentLink1URL: https://www.seielect.com/Catalog/SEI-csrf.pdf; ComponentLink1Description: https://www.seielect.com/Catalog/SEI-csrf.pdf; Supplier Part Number 1: CSRF1206FT5L00CT-ND
R36 = R_0.010SENSE_LK20: RES SMD 0.01 OHM 1% 2W 1224; Manufacturer: Ohmite; Manufacturer Part Number: LVK25R010FER; Resistance (Ohms): 0.01; Temperature Coefficient: ±100ppm/°C; Supplier 1: Digi-Key; RoHS: RoHS Compliant; Category: Resistors; Stock 1: 3676; Pricing 1: 1=1.77, 10=1.571, 25=1.4564, 50=1.3706, 100=1.1994, 250=1.028, 500=0.85668 (USD); Packaging: Cut Tape (CT); Composition: Thick Film; Features: Current Sense, Moisture Resistant; Operating Temperature: -40°C ~ 125°C; Package / Case: Wide 2412 (6231 Metric), 1224; Supplier Device Package: 1224; Size / Dimension: 0.126" L x 0.252" W (3.20mm x 6.40mm); Height: 0.028" (0.70mm); Number of Terminations: 4; ComponentLink1URL: http://www.ohmite.com/cat/res_lvk.pdf; ComponentLink1Description: http://www.ohmite.com/cat/res_lvk.pdf; Supplier Part Number 1: LVK25R010FERCT-ND
R37 = R_0402_330K: RES SMD 330K OHM 1% 1/16W 0402; Manufacturer: Yageo; Manufacturer Part Number: RC0402FR-07330KL; Temperature Coefficient: ±100ppm/°C; Supplier 1: Digi-Key; RoHS: RoHS Compliant; Category: Resistors; Stock 1: 135846; Pricing 1: 1=0.1, 10=0.013, 25=0.0096, 100=0.0054, 250=0.00412, 500=0.00328, 1000=0.00242, 2500=0.0021, 5000=0.00173 (USD); Packaging: Cut Tape (CT); Part Status: Active; Resistance (Ohms): 330k; Composition: Thick Film; Features: Moisture Resistant; Operating Temperature: -55°C ~ 155°C; Package / Case: 0402 (1005 Metric); Supplier Device Package: 0402; Size / Dimension: 0.039" L x 0.020" W (1.00mm x 0.50mm); Height - Seated (Max): 0.016" (0.40mm); Number of Terminations: 2; Failure Rate: -; ComponentLink1URL: http://www.yageo.com/NewPortal/yageodocoutput?fileName=/pdf/R-Chip/PYu-RC_Group_51_RoHS_L_4.pdf; ComponentLink1Description: http://www.yageo.com/NewPortal/yageodocoutput?fileName=/pdf/R-Chip/PYu-RC_Group_51_RoHS_L_4.pdf; Supplier Part Number 1: 311-330KLRCT-ND
R67 = R_0402_56.2k: RES 56.2K OHM 1/16W 1% 0402 SMD; Manufacturer: Vishay Dale; Manufacturer Part Number: CRCW040256K2FKED; Temperature Coefficient: ±100ppm/°C; Supplier 1: Digi-Key; Supplier Part Number 1: 541-56.2KLCT-ND; RoHS: RoHS Compliant; Category: Resistors; Stock 1: 2237; Pricing: 10=0.083, 50=0.0444, 200=0.0255, 1000=0.0174 (USD); Resistance (Ohms): 56.2k; Composition: Thick Film; Features: -; Package / Case: 0402 (1005 Metric); Size / Dimension: 0.039" L x 0.020" W (1.00mm x 0.50mm); Height: 0.016" (0.40mm); Number of Terminations: 2; Packaging: Cut Tape (CT); ComponentLink1URL: http://www.vishay.com/doc?20035; ComponentLink1Description: http://www.vishay.com/doc?20035; Resistance In Ohms: 56.2k
T12 T16 T19 = T_0603_JUMPER_PAD: SOLDER_JUMPER PAD
U1 = U_BQ40Z60RHBR: IC BATTERY MANAGER 32VQFN; Battery Chemistry: Lithium-Ion/Polymer; Number of Cells: 2 ~ 4; Fault Protection: Over Current, Short Circuit; Voltage - Supply (Max): 26V; Interface: SMBus; RoHS: RoHS Compliant; Supplier 1: Digi-Key; Category: Integrated Circuits (ICs); Stock 1: 2505; Pricing 1: 1=7.63, 10=6.918, 100=5.7023 (USD); Packaging: Cut Tape (CT); Part Status: Active; Current - Charging: -; Programmable Features: -; Charge Current - Max: -; Battery Pack Voltage: -; Operating Temperature: -40°C ~ 85°C (TA); Package / Case: 32-VFQFN Exposed Pad; Supplier Device Package: 32-VQFN (5x5); ComponentLink1URL: http://www.ti.com/lit/ds/symlink/bq40z60.pdf; ComponentLink1Description: http://www.ti.com/lit/ds/symlink/bq40z60.pdf; Supplier Part Number 1: 296-38618-1-ND